# Altium schematic sheet Pasa Bajos.SchDoc
size A4
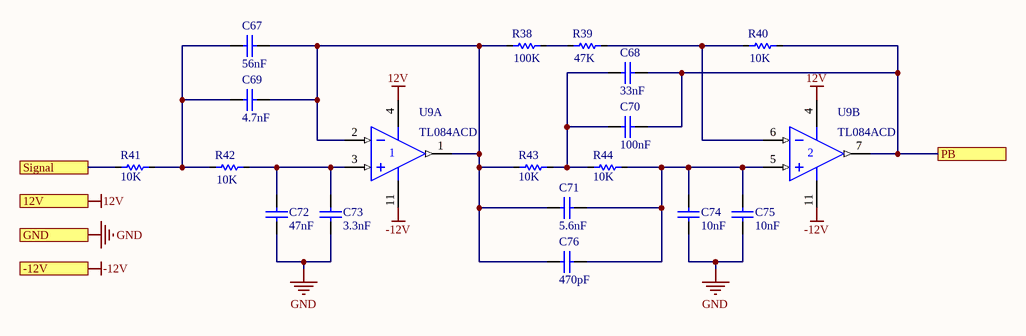
[diagram p0: Pasa Bajos.SchDoc]

## Parts
C67  VALOR: 56nF  [cap 25]  (hidden comment: Cap Ceramico Disco)
C68  VALOR: 33nF  [cap 10]  (hidden comment: Cap Ceramico Disco)
C69  VALOR: 4.7nF  [cap 10]  (hidden comment: Cap Ceramico Disco)
C70  VALOR: 100nF  [CAP DISCO 200mil]  (hidden comment: Cap Ceramico Disco)
C71  VALOR: 5.6nF  [CAP DISCO 200mil]  (hidden comment: Cap Ceramico Disco)
C72  VALOR: 47nF  [cap 10]  (hidden comment: Cap Ceramico Disco)
C73  VALOR: 3.3nF  [CAP DISCO 200mil]  (hidden comment: Cap Ceramico Disco)
C74  VALOR: 10nF  [CAP DISCO 200mil]  (hidden comment: Cap Ceramico Disco)
C75  VALOR: 10nF  [CAP DISCO 200mil]  (hidden comment: Cap Ceramico Disco)
C76  VALOR: 470pF  [CAP DISCO 200mil]  (hidden comment: Cap Ceramico Disco)
R38  VALOR: 100K  [RES AXIAL 400mil]  (hidden comment: Res SMD)
R39  VALOR: 47K  [1206 resistor]  (hidden comment: Res SMD)
R40  VALOR: 10K  [1206 resistor]  (hidden comment: Res SMD)
R41  VALOR: 10K  [1206 resistor]  (hidden comment: Res SMD)
R42  VALOR: 10K  [1206 resistor]  (hidden comment: Res SMD)
R43  VALOR: 10K  [1206 resistor]  (hidden comment: Res SMD)
R44  VALOR: 10K  [1206 resistor]  (hidden comment: Res SMD)
U9  TL084ACD  [751A-02_N]  (parts A,B of 4)

## Ports
12V, -12V, GND, PB, Signal

## Nets
12V: U9.4(V+) ; port 12V
-12V: U9.11(V-) ; port -12V
GND: C72.1 C73.1 C74.2 C75.2 ; port GND
PB: C68.2 C70.2 R40.2 U9.7(OUT) ; port PB
Signal: R41.1 ; port Signal
NetC67_1: C67.1 C69.1 C71.2 C76.2 R38.1 R43.1 U9.1(OUT) U9.2(IN-)
NetC67_2: C67.2 C69.2 R41.2 R42.1
NetC68_1: C68.1 C70.1 R43.2 R44.1
NetC71_1: C71.1 C74.1 C75.1 C76.1 R44.2 U9.5(IN+)
NetC72_2: C72.2 C73.2 R42.2 U9.3(IN+)
NetR38_2: R38.2 R39.1
NetR39_2: R39.2 R40.1 U9.6(IN-)

## Library data of the parts
C67-C76 = Cap Ceramico Disco: Capacitor Ceramico de Insercion; FABRICANTE: Generico; CODIGO STI: *; PROVEEDOR: *
U9 = TL084ACD: JFET-Input Operational Amplifier; Published: 17-Jul-2002; LatestRevisionDate: 13-Apr-2006; LatestRevisionNote: IPC-7351 Footprint Added.; DatasheetVersion: 1988; PackageVersion: 1991; PackageReference: 751A-02; Publisher: Altium Limited; PackageDescription: 14-Pin Small Outline Integrated Circuit 1.27 mm Pitch; Code_IPC: SOIC127P600-14; ComponentLink1Description: Manufacturer Link; ComponentLink1URL: http://www.onsemi.com/site/products/parametrics/0,4446,251,00.html
R38-R44 = Res SMD: CODIGO STI: *; PROVEEDOR: *; FABRICANTE: *; PART NUMBER: *